# Altium schematic sheet Joystick.SchDoc
size 420 x 297 mm; SheetNumber: 1; SheetTotal: 1; Scale: 1:1; Разраб.: Калашников Д; Обозначение документа: ВКР-15.03.06-25-КДА-10.00.01; Пров.: Политов Е.Н.; Наименование организации: ЮЗГУ МТ11-б; Перв. применение: АБВГ.123456.000; Наименование изделия 1: Плата джойстика; Наименование изделия 2: Схема электрическая; Наименование изделия 3: принципиальная; ДатаРазраб: 10.06.25; ДатаПров: 16.06.25
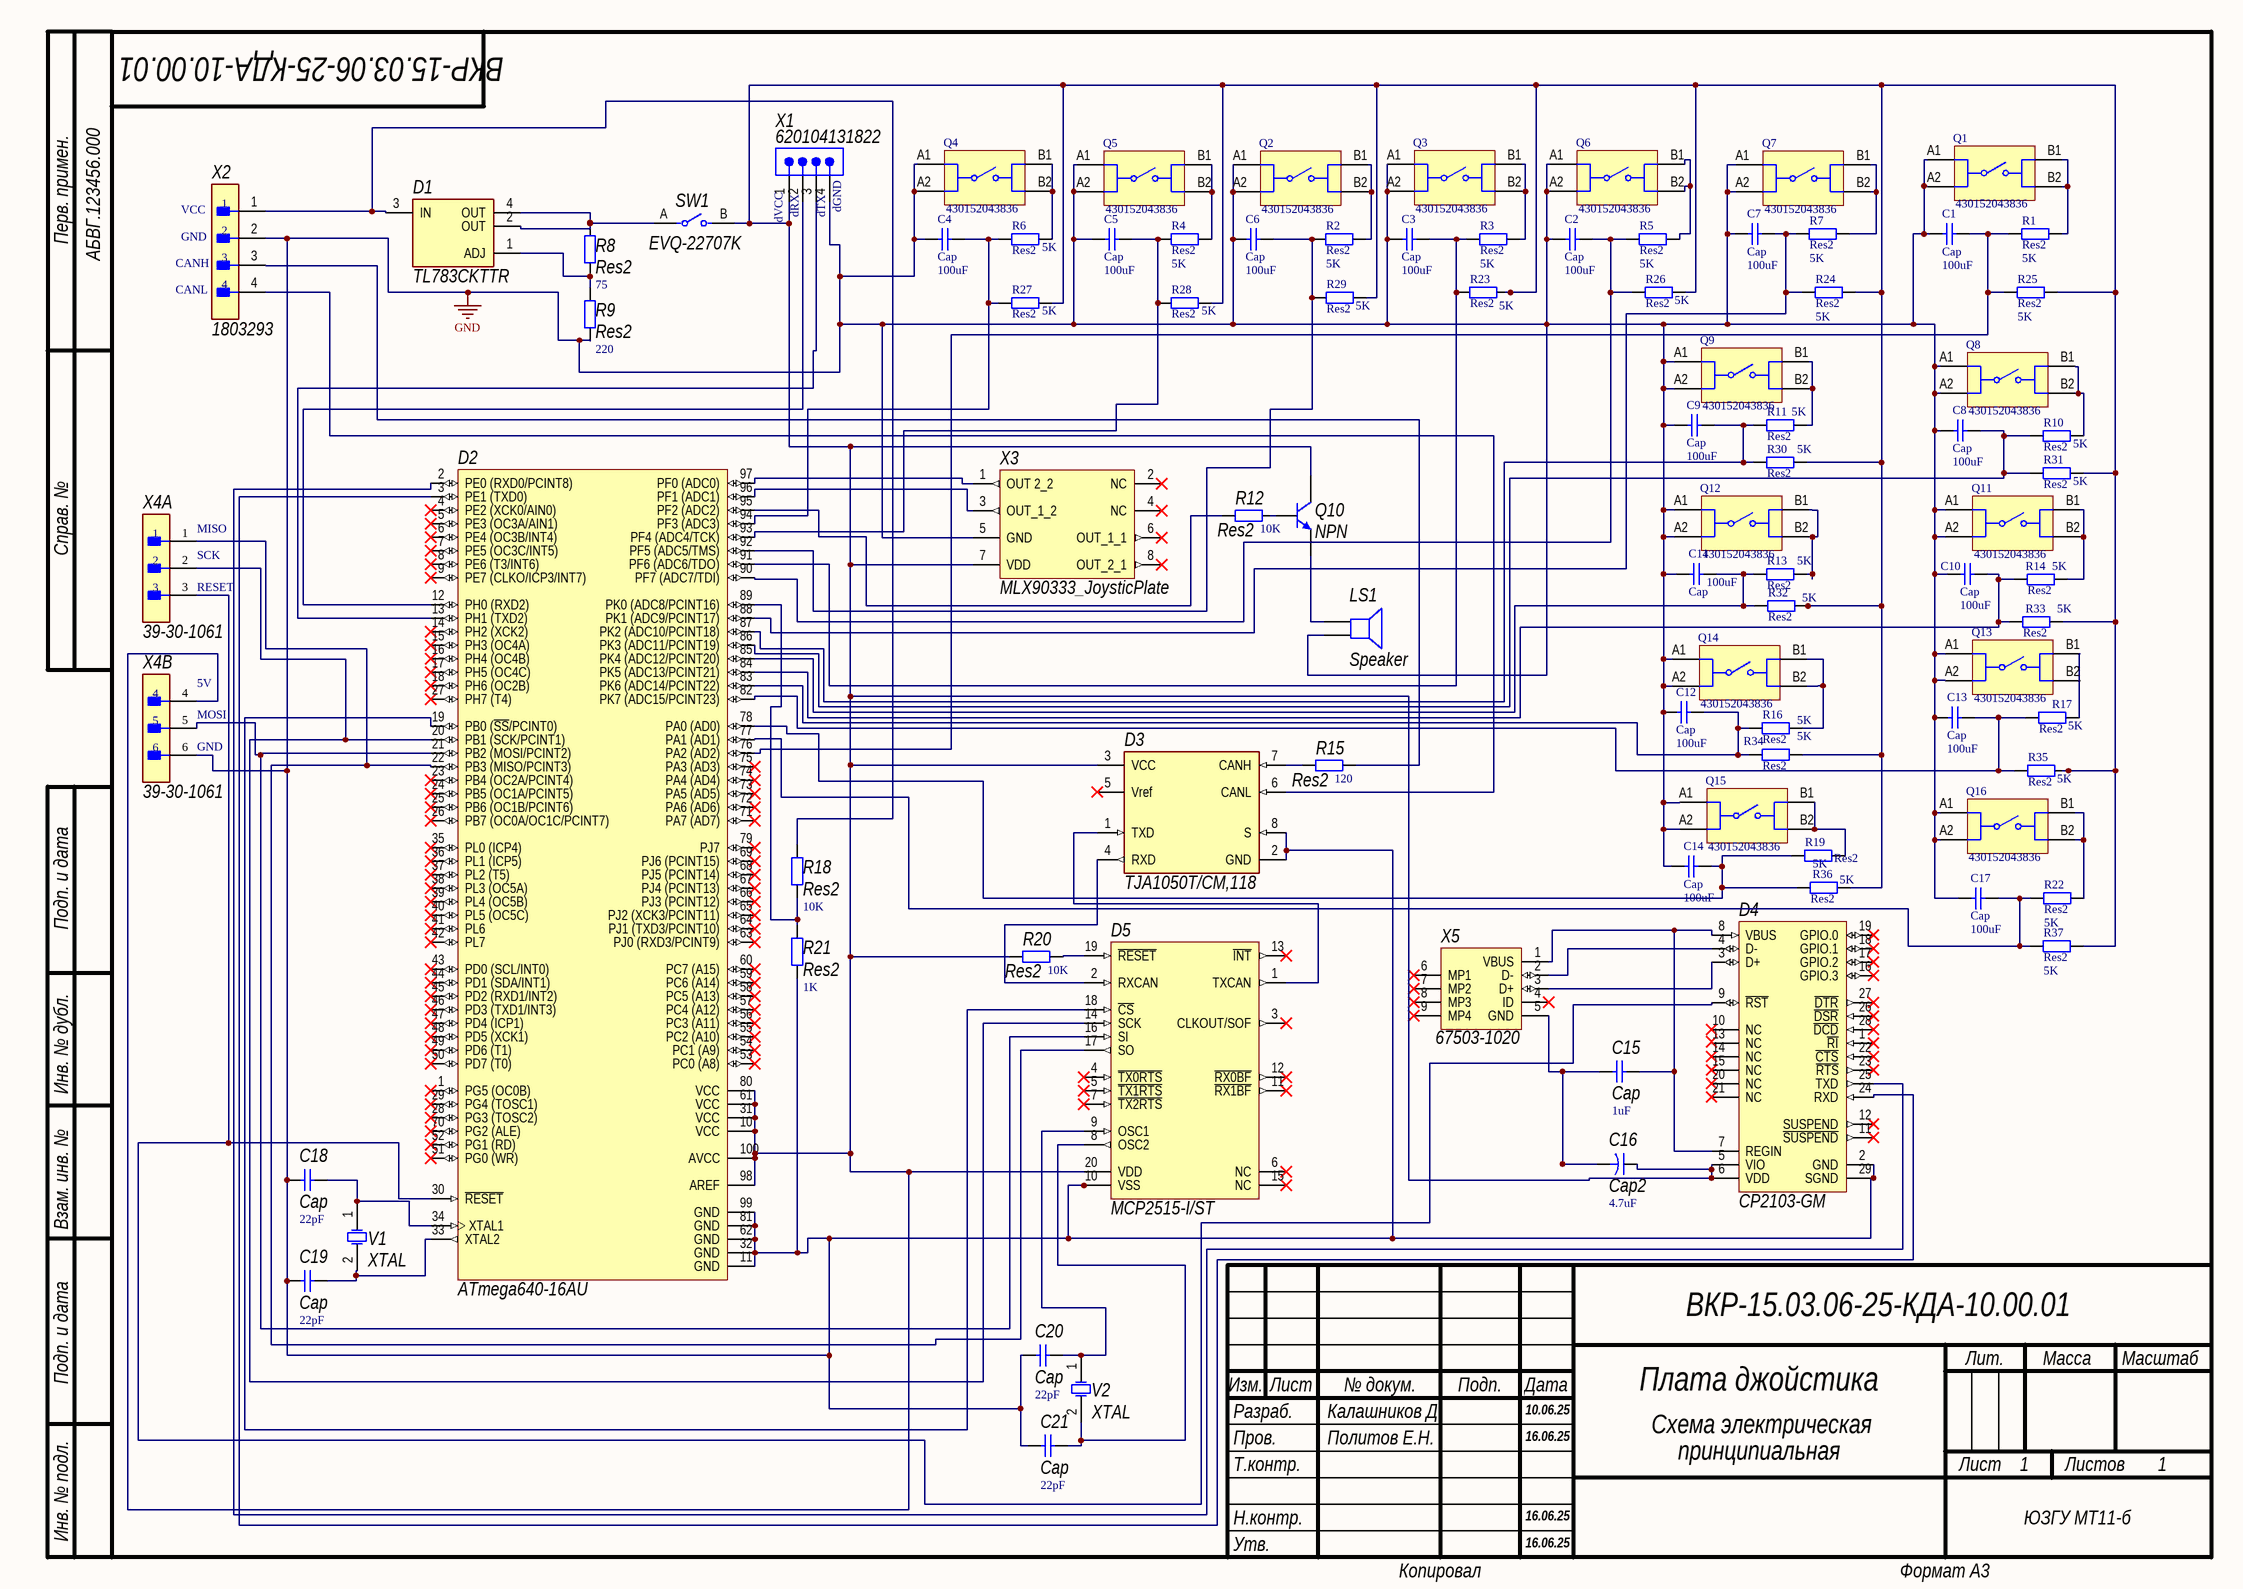
[diagram p0: Joystick.SchDoc]

## Parts
C1  Cap  value 100uF  [RAD-0.3]
C2  Cap  value 100uF  [RAD-0.3]
C3  Cap  value 100uF  [RAD-0.3]
C4  Cap  value 100uF  [RAD-0.3]
C5  Cap  value 100uF  [RAD-0.3]
C6  Cap  value 100uF  [RAD-0.3]
C7  Cap  value 100uF  [RAD-0.3]
C8  Cap  value 100uF  [RAD-0.3]
C9  Cap  value 100uF  [RAD-0.3]
C10  Cap  value 100uF  [RAD-0.3]
C11  Cap  value 100uF  [RAD-0.3]
C12  Cap  value 100uF  [RAD-0.3]
C13  Cap  value 100uF  [RAD-0.3]
C14  Cap  value 100uF  [RAD-0.3]
C15  Cap  value 1uF  [RAD-0.3]
C16  Cap2  value 4.7uF  [CAPR5-4X5]
C17  Cap  value 100uF  [RAD-0.3]
C18  Cap  value 22pF  [RAD-0.3]
C19  Cap  value 22pF  [RAD-0.3]
C20  Cap  value 22pF  [RAD-0.3]
C21  Cap  value 22pF  [RAD-0.3]
D1  TL783CKTTR  [FP-KTT0003A-MFG]
D2  ATmega640-16AU  [100A_M]
D3  TJA1050T/CM,118  [FP-SOT96-1-IPC_A]
D4  CP2103-GM  [SLAB-QFN-28-3125x3125TP_A_M]
D5  MCP2515-I/ST  [TSSOP-ST20_N]
LS1  Speaker  [PIN2]
Q1  430152043836  [WS-TASV_L6W6H4.3_4301x20438x6]
Q2  430152043836  [WS-TASV_L6W6H4.3_4301x20438x6]
Q3  430152043836  [WS-TASV_L6W6H4.3_4301x20438x6]
Q4  430152043836  [WS-TASV_L6W6H4.3_4301x20438x6]
Q5  430152043836  [WS-TASV_L6W6H4.3_4301x20438x6]
Q6  430152043836  [WS-TASV_L6W6H4.3_4301x20438x6]
Q7  430152043836  [WS-TASV_L6W6H4.3_4301x20438x6]
Q8  430152043836  [WS-TASV_L6W6H4.3_4301x20438x6]
Q9  430152043836  [WS-TASV_L6W6H4.3_4301x20438x6]
Q10  NPN  [TO-226-AA]
Q11  430152043836  [WS-TASV_L6W6H4.3_4301x20438x6]
Q12  430152043836  [WS-TASV_L6W6H4.3_4301x20438x6]
Q13  430152043836  [WS-TASV_L6W6H4.3_4301x20438x6]
Q14  430152043836  [WS-TASV_L6W6H4.3_4301x20438x6]
Q15  430152043836  [WS-TASV_L6W6H4.3_4301x20438x6]
Q16  430152043836  [WS-TASV_L6W6H4.3_4301x20438x6]
R1  Res2  value 5K  [AXIAL-0.4]
R2  Res2  value 5K  [AXIAL-0.4]
R3  Res2  value 5K  [AXIAL-0.4]
R4  Res2  value 5K  [AXIAL-0.4]
R5  Res2  value 5K  [AXIAL-0.4]
R6  Res2  value 5K  [AXIAL-0.4]
R7  Res2  value 5K  [AXIAL-0.4]
R8  Res2  value 75  [AXIAL-0.4]
R9  Res2  value 220  [AXIAL-0.4]
R10  Res2  value 5K  [AXIAL-0.4]
R11  Res2  value 5K  [AXIAL-0.4]
R12  Res2  value 10K  [AXIAL-0.4]
R13  Res2  value 5K  [AXIAL-0.4]
R14  Res2  value 5K  [AXIAL-0.4]
R15  Res2  value 120  [AXIAL-0.4]
R16  Res2  value 5K  [AXIAL-0.4]
R17  Res2  value 5K  [AXIAL-0.4]
R18  Res2  value 10K  [AXIAL-0.4]
R19  Res2  value 5K  [AXIAL-0.4]
R20  Res2  value 10K  [AXIAL-0.4]
R21  Res2  value 1K  [AXIAL-0.4]
R22  Res2  value 5K  [AXIAL-0.4]
R23  Res2  value 5K  [AXIAL-0.4]
R24  Res2  value 5K  [AXIAL-0.4]
R25  Res2  value 5K  [AXIAL-0.4]
R26  Res2  value 5K  [AXIAL-0.4]
R27  Res2  value 5K  [AXIAL-0.4]
R28  Res2  value 5K  [AXIAL-0.4]
R29  Res2  value 5K  [AXIAL-0.4]
R30  Res2  value 5K  [AXIAL-0.4]
R31  Res2  value 5K  [AXIAL-0.4]
R32  Res2  value 5K  [AXIAL-0.4]
R33  Res2  value 5K  [AXIAL-0.4]
R34  Res2  value 5K  [AXIAL-0.4]
R35  Res2  value 5K  [AXIAL-0.4]
R36  Res2  value 5K  [AXIAL-0.4]
R37  Res2  value 5K  [AXIAL-0.4]
SW1  EVQ-22707K  [FP-EVQ-22707K-MFG]
V1  XTAL  [R38]
V2  XTAL  [R38]
X1  620104131822  [620104131822]
X2  1803293  [FP-1803293-MFG]
X3  MLX90333_JoysticPlate  [MLX90333_Joy]
X4  39-30-1061  [FP-39-30-1061-MFG]  (parts A,B of 2)
X5  67503-1020  [MOLX-67503-1020_V]

## Nets
GND: C1.1 C2.1 C3.1 C4.1 C5.1 C6.1 C7.1 C8.1 C9.2 C10.2 C11.1 C12.1 C13.1 C14.1 C17.1 C18.2 C19.1 C20.1 C21.1 D2.11(GND) D2.32(GND) D2.62(GND) D2.81(GND) D2.99(GND) D3.2(GND) D3.8(S) D4.2(GND) D4.29(SGND) D5.10(VSS) LS1.2 Q1.A1 Q1.A2 Q2.A1 Q2.A2 Q3.A1 Q3.A2 Q4.A1 Q4.A2 Q5.A1 Q5.A2 Q6.A1 Q6.A2 Q7.A1 Q7.A2 Q8.A1 Q8.A2 Q9.A1 Q9.A2 Q11.A1 Q11.A2 Q12.A1 Q12.A2 Q13.A1 Q13.A2 Q14.A1 Q14.A2 Q15.A1 Q15.A2 Q16.A1 Q16.A2 R9.2 R21.1 X1.4 X2.2 X3.5(GND) X4.6
NetC1_2: C1.2 D2.76(PA2_(AD2)) R1.2 R25.2
NetC2_2: C2.2 D2.90(PF7_(ADC7/TDI)) R5.2 R26.2
NetC3_2: C3.2 D2.91(PF6_(ADC6/TDO)) R3.2 R23.2
NetC4_2: C4.2 D2.94(PF3_(ADC3)) R6.2 R27.2
NetC5_2: C5.2 D2.93(PF4_(ADC4/TCK)) R4.2 R28.2
NetC6_2: C6.2 D2.92(PF5_(ADC5/TMS)) R2.2 R29.2
NetC7_2: C7.2 D2.88(PK1_(ADC9/PCINT17)) R7.2 R24.2
NetC8_2: C8.2 D2.86(PK3_(ADC11/PCINT19)) R10.2 R31.2
NetC9_1: C9.1 D2.87(PK2_(ADC10/PCINT18)) R11.2 R30.2
NetC10_1: C10.1 D2.84(PK5_(ADC13/PCINT21)) R14.1 R33.1
NetC11_2: C11.2 D2.85(PK4_(ADC12/PCINT20)) R13.1 R32.1
NetC12_2: C12.2 D2.83(PK6_(ADC14/PCINT22)) R16.2 R34.2
NetC13_2: C13.2 D2.82(PK7_(ADC15/PCINT23)) R17.2 R35.2
NetC14_2: C14.2 D2.78(PA0_(AD0)) R19.1 R36.1
NetC15_1: C15.1 D4.7(REGIN) D4.8(VBUS) X5.1(VBUS)
NetC15_2: C15.2 C16.2 X5.5(GND)
NetC16_1: C16.1 D2.10(VCC) D2.31(VCC) D2.61(VCC) D2.80(VCC) D2.98(AREF) D2.100(AVCC) D3.3(VCC) D4.5(VIO) D4.6(VDD) D5.20(VDD) Q10.1(C) R20.1 R23.1 R24.1 R25.1 R26.1 R27.1 R28.1 R29.1 R30.1 R31.1 R32.2 R33.2 R34.1 R35.1 R36.2 R37.2 SW1.B X1.1 X3.7(VDD) X4.4
NetC17_2: C17.2 D2.77(PA1_(AD1)) R22.1 R37.1
NetC18_1: C18.1 D2.34(XTAL1) V1.1(OSC1)
NetC19_2: C19.2 D2.33(XTAL2) V1.2(OSC2)
NetC20_2: C20.2 D5.9(OSC1) V2.1(OSC1)
NetC21_2: C21.2 D5.8(OSC2) V2.2(OSC2)
NetD1_1: D1.1(ADJ) R8.2 R9.1
NetD1_2: D1.2(OUT) D1.4(OUT) R8.1 SW1.A
NetD1_3: D1.3(IN) R18.2 X2.1
NetD2_2: D2.2(PE0_(RXD0/PCINT8)) D4.25(TXD)
NetD2_3: D2.3(PE1_(TXD0)) D4.24(RXD)
NetD2_12: D2.12(PH0_(RXD2)) X1.2
NetD2_13: D2.13(PH1_(TXD2)) X1.3
NetD2_19: D2.19(PB0_(~{SS}/PCINT0)) D5.18(~{CS})
NetD2_20: D2.20(PB1_(SCK/PCINT1)) D5.14(SCK) X4.2
NetD2_21: D2.21(PB2_(MOSI/PCINT2)) D5.16(SI) X4.5
NetD2_22: D2.22(PB3_(MISO/PCINT3)) D5.17(SO) X4.1
NetD2_30: D2.30(~{RESET}) D4.9(~{RST}) X4.3
NetD2_89: D2.89(PK0_(ADC8/PCINT16)) R18.1 R21.2
NetD2_95: D2.95(PF2_(ADC2)) R12.1
NetD2_96: D2.96(PF1_(ADC1)) X3.3(OUT_1_2)
NetD2_97: D2.97(PF0_(ADC0)) X3.1(OUT_2_2)
NetD3_1: D3.1(TXD) D5.1(TXCAN)
NetD3_4: D3.4(RXD) D5.2(RXCAN)
NetD3_6: D3.6(CANL) X2.4
NetD3_7: D3.7(CANH) R15.1
NetD4_3: D4.3(D+) X5.3(D+)
NetD4_4: D4.4(D-) X5.2(D-)
NetD5_19: D5.19(~{RESET}) R20.2
NetLS1_1: LS1.1 Q10.3(E)
NetQ1_B1: Q1.B1 Q1.B2 R1.1
NetQ2_B1: Q2.B1 Q2.B2 R2.1
NetQ3_B1: Q3.B1 Q3.B2 R3.1
NetQ4_B1: Q4.B1 Q4.B2 R6.1
NetQ5_B1: Q5.B1 Q5.B2 R4.1
NetQ6_B1: Q6.B1 Q6.B2 R5.1
NetQ7_B1: Q7.B1 Q7.B2 R7.1
NetQ8_B1: Q8.B1 Q8.B2 R10.1
NetQ9_B1: Q9.B1 Q9.B2 R11.1
NetQ10_2: Q10.2(B) R12.2
NetQ11_B1: Q11.B1 Q11.B2 R14.2
NetQ12_B1: Q12.B1 Q12.B2 R13.2
NetQ13_B1: Q13.B1 R17.1
NetQ14_B1: Q14.B1 Q14.B2 R16.1
NetQ15_B1: Q15.B1 Q15.B2 R19.2
NetQ16_B1: Q16.B1 Q16.B2 R22.2
NetR15_2: R15.2 X2.3

Not connected (* = marked no-connect by the designer): D2 1(PG5_(OC0B))* 4(PE2_(XCK0/AIN0))* 5(PE3_(OC3A/AIN1))* 6(PE4_(OC3B/INT4))* 7(PE5_(OC3C/INT5))* 8(PE6_(T3/INT6))* 9(PE7_(CLKO/ICP3/INT7))* 14(PH2_(XCK2))* 15(PH3_(OC4A))* 16(PH4_(OC4B))* 17(PH5_(OC4C))* 18(PH6_(OC2B))* 23(PB4_(OC2A/PCINT4))* 24(PB5_(OC1A/PCINT5))* 25(PB6_(OC1B/PCINT6))* 26(PB7_(OC0A/OC1C/PCINT7))* 27(PH7_(T4))* 28(PG3_(TOSC2))* 29(PG4_(TOSC1))* 35(PL0_(ICP4))* 36(PL1_(ICP5))* 37(PL2_(T5))* 38(PL3_(OC5A))* 39(PL4_(OC5B))* 40(PL5_(OC5C))* 41(PL6)* 42(PL7)* 43(PD0_(SCL/INT0))* 44(PD1_(SDA/INT1))* 45(PD2_(RXD1/INT2))* 46(PD3_(TXD1/INT3))* 47(PD4_(ICP1))* 48(PD5_(XCK1))* 49(PD6_(T1))* 50(PD7_(T0))* 51(PG0_(WR))* 52(PG1_(RD))* 53(PC0_(A8))* 54(PC1_(A9))* 55(PC2_(A10))* 56(PC3_(A11))* 57(PC4_(A12))* 58(PC5_(A13))* 59(PC6_(A14))* 60(PC7_(A15))* 63(PJ0_(RXD3/PCINT9))* 64(PJ1_(TXD3/PCINT10))* 65(PJ2_(XCK3/PCINT11))* 66(PJ3_(PCINT12))* 67(PJ4_(PCINT13))* 68(PJ5_(PCINT14))* 69(PJ6_(PCINT15))* 70(PG2_(ALE))* 71(PA7_(AD7))* 72(PA6_(AD6))* 73(PA5_(AD5))* 74(PA4_(AD4))* 75(PA3_(AD3))* 79(PJ7)*; D3 5(Vref)*; D4 1(~{RI})* 10(NC)* 11(~{SUSPEND})* 12(SUSPEND)* 13(NC) 14(NC)* 15(NC)* 16(GPIO.3)* 17(GPIO.2)* 18(GPIO.1)* 19(GPIO.0)* 20(NC)* 21(NC)* 22(~{CTS})* 23(~{RTS})* 26(~{DSR})* 27(~{DTR})* 28(~{DCD})*; D5 3(CLKOUT/SOF)* 4(~{TX0RTS})* 5(~{TX1RTS})* 6(NC)* 7(~{TX2RTS})* 11(~{RX1BF})* 12(~{RX0BF})* 13(~{INT})* 15(NC)*; Q13 B2; X3 2(NC)* 4(NC)* 6(OUT_1_1)* 8(OUT_2_1)*; X5 4(ID)* 6(MP1)* 7(MP2)* 8(MP3)* 9(MP4)*

## Notes on the sheet
- (near X2) VCC
- (near X2) GND
- (near X1) dVCC
- (near X1) dRX
- (near X1) dTX
- (near X1) dGND
- (near X2) CANH
- (near X2) CANL
- (near X4) MISO
- (near X4) SCK
- (near X4) RESET
- (near X4) MOSI
- (near X4) 5V
- (near X4) GND
- Перв. примен.
- Справ. №
- Подп. и дата
- Инв. № дубл.
- Взам. инв. №
- Разраб.
- Изм.
- Лист
- № докум.
- Подп.
- Дата
- Лит.
- Масса
- Масштаб
- Пров.
- Т.контр.
- Листов
- Инв. № подл.
- Утв.
- Н.контр.
- Копировал
- Формат А3

## Library data of the parts
C1-C15 C17-C21 = Cap: Capacitor; Published: 8-Jun-2000; LatestRevisionDate: 17-Jul-2002; LatestRevisionNote: Re-released for DXP Platform.; PackageReference: RAD-0.3; Publisher: Altium Limited; PackageDescription: Radial Cap, Thru-Hole; 2 Leads; 0.3 in Pin Spacing
C16 = Cap2: Capacitor; Published: 23-Sep-2002; PackageReference: CAPR5-4X5; Publisher: Altium Limited; PackageDescription: Capacitor; 2 Leads
D1 = CMP-04917-000064-1: IC REG LIN POS ADJ 700MA DDPAK; Max Input Voltage: 150V; Polarity: Positive; Number of Regulators: 1; Min Input Voltage: 21.5V; Reference Voltage: 1.3V; Output Voltage: 125V; Dropout Voltage: 10V; Output Type: Adjustable; Power Supply Rejection Ratio (PSRR): 76dB; Quiescent Current: 15mA; Min Output Voltage: 1.25V; Weight: 0.050897oz; Height: 4.44mm; Package Quantity: 1; Min Operating Temperature: 0°C; Case/Package: TO-263; Packaging: Tape and Reel; REACH SVHC: No SVHC; Lead Free: Lead Free; Width: 8.41mm; Radiation Hardening: No; Number of Pins: 3; Output Current: 700mA; Number of Outputs: 1; Max Operating Temperature: 125°C; Min Current Limit: 700mA; Mount: Surface Mount; Max Output Current: 700mA; Max Output Voltage: 125V; Length: 10.18mm
D2 = CMP-0095-00194-2: 8-bit AVR Microcontroller, 2.7-5.5V, 8MHz, 64KB Flash, 4KB EEPROM, 8KB SRAM, 86 GPIO pins, 100-pin TQFP, Industrial Grade (-40°C to 85°C), Pb-Free; Code_JEDEC: MS-026-AED; ComponentLink1URL: http://www.atmel.com/; RevisionNote: DatasheetVersion & PackageVersion updated. URLs added.; DatasheetVersion: revN, May-2011; ComponentLink3Description: ATmega640/1280/1281/2560/2561 Summary; ComponentLink1Description: Manufacturer URL; ComponentLink2Description: ATmega640/1280/1281/2560/2561 Datasheet; ComponentLink2URL: http://www.atmel.com/dyn/resources/prod_documents/doc2549.pdf; ComponentLink3URL: http://www.atmel.com/dyn/resources/prod_documents/2549S.pdf; PackageVersion: revD, Oct-2010; PackageReference: 100A; PackageDescription: 100-Pin Thin Profile Plastic Quad Flat Pack (TQFP), 14 x 14 x 1.0 mm Body, 0.5 mm Pitch
D3 = CMP-2000-04923-2: IC TRANSCEIVER HALF 1/1 8SO; Simplex/Duplex: Half Duplex; Max Supply Current: 10mA; Number of Receive Buffers: 1; Min Supply Voltage: 4.75V; Max Supply Voltage: 5.25V; Interface: CAN; Data Rate: 1Mbps; Receiver Hysteresis: 70mV; Number of Transmit Buffers: 1; Min Operating Temperature: -40°C; Case/Package: SO; REACH SVHC: No SVHC; Max Operating Temperature: 150°C; Number of Pins: 8; Lead Free: Lead Free; Number of Transceivers: 1; Packaging: Tape and Reel; Mount: Surface Mount; Radiation Hardening: No; Nominal Supply Current: 10mA; Package Quantity: 2500; Contact Plating: Gold
D4 = CMP-0511-00006-1: Single-Chip USB to UART Bridge, 1024 Bytes EEPROM, -40 to 85 degC, 28-pin QFN, Tube; Manufacturer: Silicon Labs; Internal Oscillator: TRUE; Sub-Family: USB Bridges; PackageDescription: 28-Pin Quad-Flat No-Leads Package, Body 5 x 5 mm, Pitch 0.5 mm; PartNumber: CP2103-GM; ComponentLink2Description: Datasheet; ComponentLink2URL: http://www.silabs.com/Support%20Documents/TechnicalDocs/CP2103.pdf; ComponentLink1URL: http://www.silabs.com/; Mounting Technology: Surface Mount; ComponentLink1Description: Manufacturer URL; PackageReference: QFN-28; EEPROM: 1024 Bytes; DatasheetVersion: Rev. 1.0; ComponentLink3Description: Package Specification; ComponentLink3URL: http://www.silabs.com/Support%20Documents/TechnicalDocs/C8051F35x.pdf
D5 = CMP-0186-00077-2: Stand-Alone CAN Controller With SPI Interface, 20-Pin TSSOP, Industrial Temperature; DatasheetVersion: revF, Oct-2010; ComponentLink1Description: Manufacturer URL; PackageDescription: 20-Lead Plastic Thin Shrink Small Outline (ST) - 4.4mm Body [TSSOP]; ComponentLink1URL: http://www.microchip.com/; RevisionNote: URLs added. DatasheetVersion updated.; PackageReference: TSSOP-ST20; Code_JEDEC: MO-153-AC; ComponentLink2Description: Datasheet; ComponentLink2URL: http://ww1.microchip.com/downloads/en/DeviceDoc/21801f.pdf; PackageVersion: revBB, Aug-2009; ComponentLink3URL: http://www.microchip.com/stellent/groups/techpub_sg/documents/packagingspec/en012702.pdf; ComponentLink3Description: Package Specification
LS1 = Speaker: Loudspeaker; Published: 24-Mar-1999; LatestRevisionDate: 17-Jul-2002; LatestRevisionNote: Re-released for DXP Platform.; PackageReference: PIN2; Publisher: Altium Limited
Q1-Q9 Q11-Q16 = CMP-1452-00002-2: NexarPartId: 22861785; Voltage Rating: 12V; Current Rating: 50mA; Switch Travel: 250µm; Switch Function: Off-Mom; Color: Orange; Actuator Material: Liquid Crystal Polymer, Polymer; Insulation Resistance: 100MΩ; Actuator Length: 900µm; Throw Configuration: SPST; Mechanical Life: 200kcycles; Illumination Type: Illuminated, Non-Illuminated; Mount: Surface Mount; Max Operating Temperature: 85°C; Height: 4.3mm; RoHS: Compliant; Length: 6.2mm; Width: 6.2mm; Contact Current Rating: 50mA; Diameter: 3.5mm; Termination: Gull Wing; Packaging: Tape and Reel; REACH SVHC: No SVHC; Contact Plating: Silver; Min Operating Temperature: -40°C; Contact Material: Stainless Steel, Steel
Q10 = NPN: NPN Bipolar Transistor; Published: 8-Jun-2000; LatestRevisionDate: 17-Jul-2002; LatestRevisionNote: Re-released for DXP Platform.; PackageReference: TO-226-AA; Publisher: Altium Limited; PackageDescription: TO, Flat Index; 3 In-Line, Axial Leads; Body Dia. 4.8mm; Leads 0.55 x 0.51 mm (max); Code_JEDEC: TO-226-AA
R1-R37 = Res2: Resistor; Published: 8-Jun-2000; LatestRevisionDate: 17-Jul-2002; LatestRevisionNote: Re-released for DXP Platform.; PackageReference: AXIAL-0.4; Publisher: Altium Limited; PackageDescription: Axial Device, Thru-Hole; 2 Leads; 0.4 in Pin Spacing
SW1 = CMP-05618-000065-1: SWITCH TACTILE SPST-NO 0.02A 15V; Contact Resistance: 50mR; Actuator Color: Black; Actuator Length: 3.6mm; Illumination Type: Non-Illuminated; Switch Travel: 0.25mm; Current Rating: 20mA; Operating Force: 2.6N; Throw Configuration: SPST; Actuator Type: Standard; Mechanical Life: 50000Cycles; Switch Function: Off-Mom; Size: 6mm; Max Voltage Rating (DC): 15V; Package Quantity: 1; Orientation: Straight; Max Operating Temperature: 70°C; Packaging: Tape and Reel; Lead Free: Lead Free; Termination: PC Pin; Radiation Hardening: No; Min Operating Temperature: -20°C; Series: EVQ2; Mount: Through Hole; Contact Current Rating: 20mA; Case/Package: Radial; Voltage Rating (DC): 15V; RoHS Compliant: Yes; Electrical Life: 50000Cycles
V1 V2 = XTAL: Crystal Oscillator; Published: 8-Jun-2000; LatestRevisionDate: 17-Jul-2002; LatestRevisionNote: Re-released for DXP Platform.; PackageReference: R38; Publisher: Altium Limited; PackageDescription: Crystal, Thru-Hole; 2 Leads; Body 3.1 x 8.2 mm (Dia.xH)
X1 = CMP-1502-00671-2: NexarPartId: 18818240; Number of Positions: 4; Operating Supply Voltage: 100V; Connector Type: Male Pin; Insulation: Insulated; Pitch: 2mm; Insulation Resistance: 1GΩ; Contact Resistance: 20mΩ; Voltage Rating: 125V; Current Rating: 2A; Gender: Male; Width: 12mm; Flammability Rating: UL94 V-0; Contact Gender: Male; REACH SVHC: Unknown; Packaging: Tape and Reel; Contact Plating: Tin; Termination: SMD/SMT; Number of Rows: 1; Mount: Surface Mount; Contact Mating Length: 3.683mm; Lead Free: Lead Free; Housing Material: Nylon; Number of Contacts: 4; RoHS: Compliant; Min Operating Temperature: -40°C; Number of Pins: 4; Length: 12mm; Height: 5.6mm; Max Operating Temperature: 85°C; Color: Beige, White; Contact Material: Copper; Lead Pitch: 2mm
X2 = CMP-09399-000011-1: TERM BLOCK HDR 4POS 90DEG 3.81MM; Connector Type: PCB; Number of Poles: 4; Number of Levels: 1; Voltage Rating: 160V; Approvals: UL; Current: 8A; Voltage Rating (DC): 640mV; Test Voltage: 2.5kV; Voltage: 300V; Contact Gender: Male; Series: MC; Mount: Through Hole; Number of Positions: 4; Color: Green; Packaging: Bulk; Length: 16.63mm; Width: 18.7mm; Max Current Rating: 8A; Contact Plating: Tin; Package Quantity: 50; Pitch: 3.81mm; Lead Free: Lead Free; Termination: Solder; Weight: 4oz; Number of Positions Per Level: 4; Depth: 9.2mm; Flammability Rating: UL94 V-0; Number of Contacts: 4; Housing Color: Green; Number of Rows: 1; Current Rating: 8A; Housing Material: Polybutylene; Orientation: Right Angle
X4 = CMP-00257-00276738-1: 39-30-1061 Connector Wire to Board Header 6 Position 4.2mm Solder Right Angle Thru-Hole Tray; NexarPartId: 276738; Number of Positions: 6; Insulation Resistance: 1GΩ; Number of Ports: 1; Current Rating: 8A; Contact Resistance: 10mΩ; Gender: Male; Max Current Rating: 5A; Voltage Rating (DC): 600V; Glow Wire Compliant: Non-compliant; Termination: Solder; Min Operating Temperature: -40°C; Length: 13.8mm; Number of Circuits: 6; REACH SVHC: Unknown; RoHS: Compliant; Row Spacing: 4.2mm; Material: Brass; Housing Color: Natural; Contact Plating: Gold; Number of Rows: 2; Packaging: Bulk; Color: Natural; Height: 5.57mm; ELV: Compliant; Schedule B: 8536694040; Halogen Free: Low Halogen; Contact Gender: Male; Mount: Surface Mount, Through Hole; Housing Material: Nylon; Number of Contacts: 6; Contact Material: Brass, Gold; Lead Pitch: 4.2mm; Radiation Hardening: No; Pitch: 4.2mm; Lead Free: Lead Free; Depth: 19.4mm; Number of Terminals: 6; Flammability Rating: UL94 V-2; Orientation: Right Angle; Voltage Rating: 600V; Max Operating Temperature: 105°C
X5 = CMP-0411-00002-1: USB, MINI, SMD, RA KME04-USBMU03A01; Manufacturer: Molex; ComponentLink1URL: http://www.molex.com/; PartNumber: 67503-1020; Mounting Technology: Surface Mount; ComponentLink1Description: Manufacturer URL; Terminal Pitch: 0.8 mm; DatasheetVersion: Rev F, 06/2009; ComponentLink2Description: Datasheet; PackageDescription: Mini USB Connector, SMT, Righer Angle; ComponentLink2URL: http://www.molex.com/pdm_docs/sd/675031020_sd.pdf; PackageReference: 67503-1020